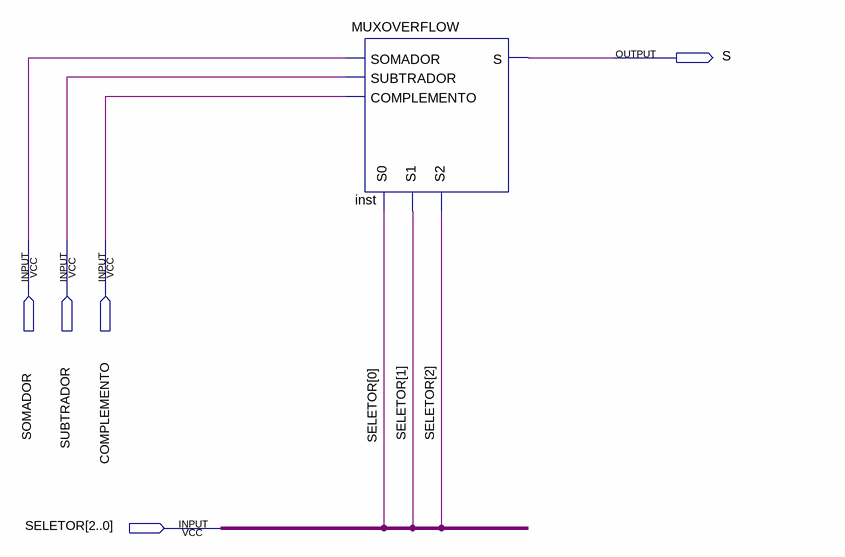
[diagram p0: schematic sheet]
// Quartus schematic MUXOVERFLOW2.bdf as structural Verilog: 1 symbols, 5 pins
module MUXOVERFLOW2 (
  input  SOMADOR,
  input  SUBTRADOR,
  input  COMPLEMENTO,
  input  [2:0] SELETOR,
  output S
);

  MUXOVERFLOW inst (
    .SOMADOR(SOMADOR), .SUBTRADOR(SUBTRADOR), .COMPLEMENTO(COMPLEMENTO), .S2(SELETOR[2]), .S1(SELETOR[1]),
    .S0(SELETOR[0]), .S(S));
endmodule
